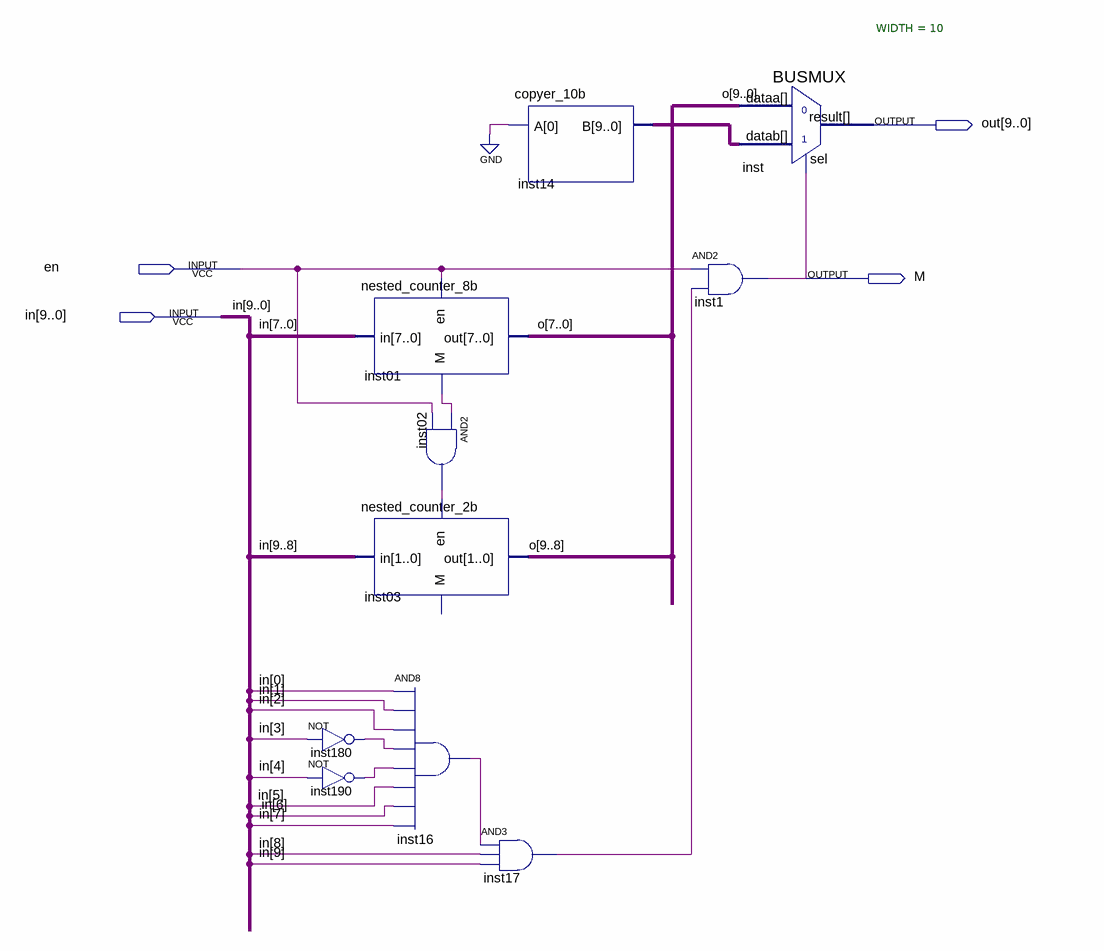
[diagram p0: schematic sheet]
// Quartus schematic nested_counter_kd.bdf as structural Verilog: 10 symbols, 4 pins
module nested_counter_kd (
  input  en,
  input  [9:0] in,
  output [9:0] out,
  output M
);

  wire inst01_m, inst02_out, inst16_out, inst17_out, inst180_out, inst190_out;
  wire [9:0] inst14_b, o;

  not inst180 (inst180_out, in[3]);
  not inst190 (inst190_out, in[4]);
  nested_counter_8b inst01 (.en(en), .in(in[7:0]), .out(o[7:0]), .M(inst01_m));
  and inst02 (inst02_out, inst01_m, en);
  nested_counter_2b inst03 (.en(inst02_out), .in(in[9:8]), .out(o[9:8]));  // open: M
  and inst16 (inst16_out, in[0], in[1], in[2], inst180_out, inst190_out, in[5], in[6], in[7]);
  and inst17 (inst17_out, inst16_out, in[8], in[9]);
  copyer_10b inst14 (.A(1'b0), .B(inst14_b));
  and inst1 (M, en, inst17_out);
  BUSMUX #(.WIDTH(10)) inst (.datab(inst14_b), .sel(M), .dataa(o), .result(out));
endmodule
